# EAGLE schematic K104 (EAGLE 9.2.0)
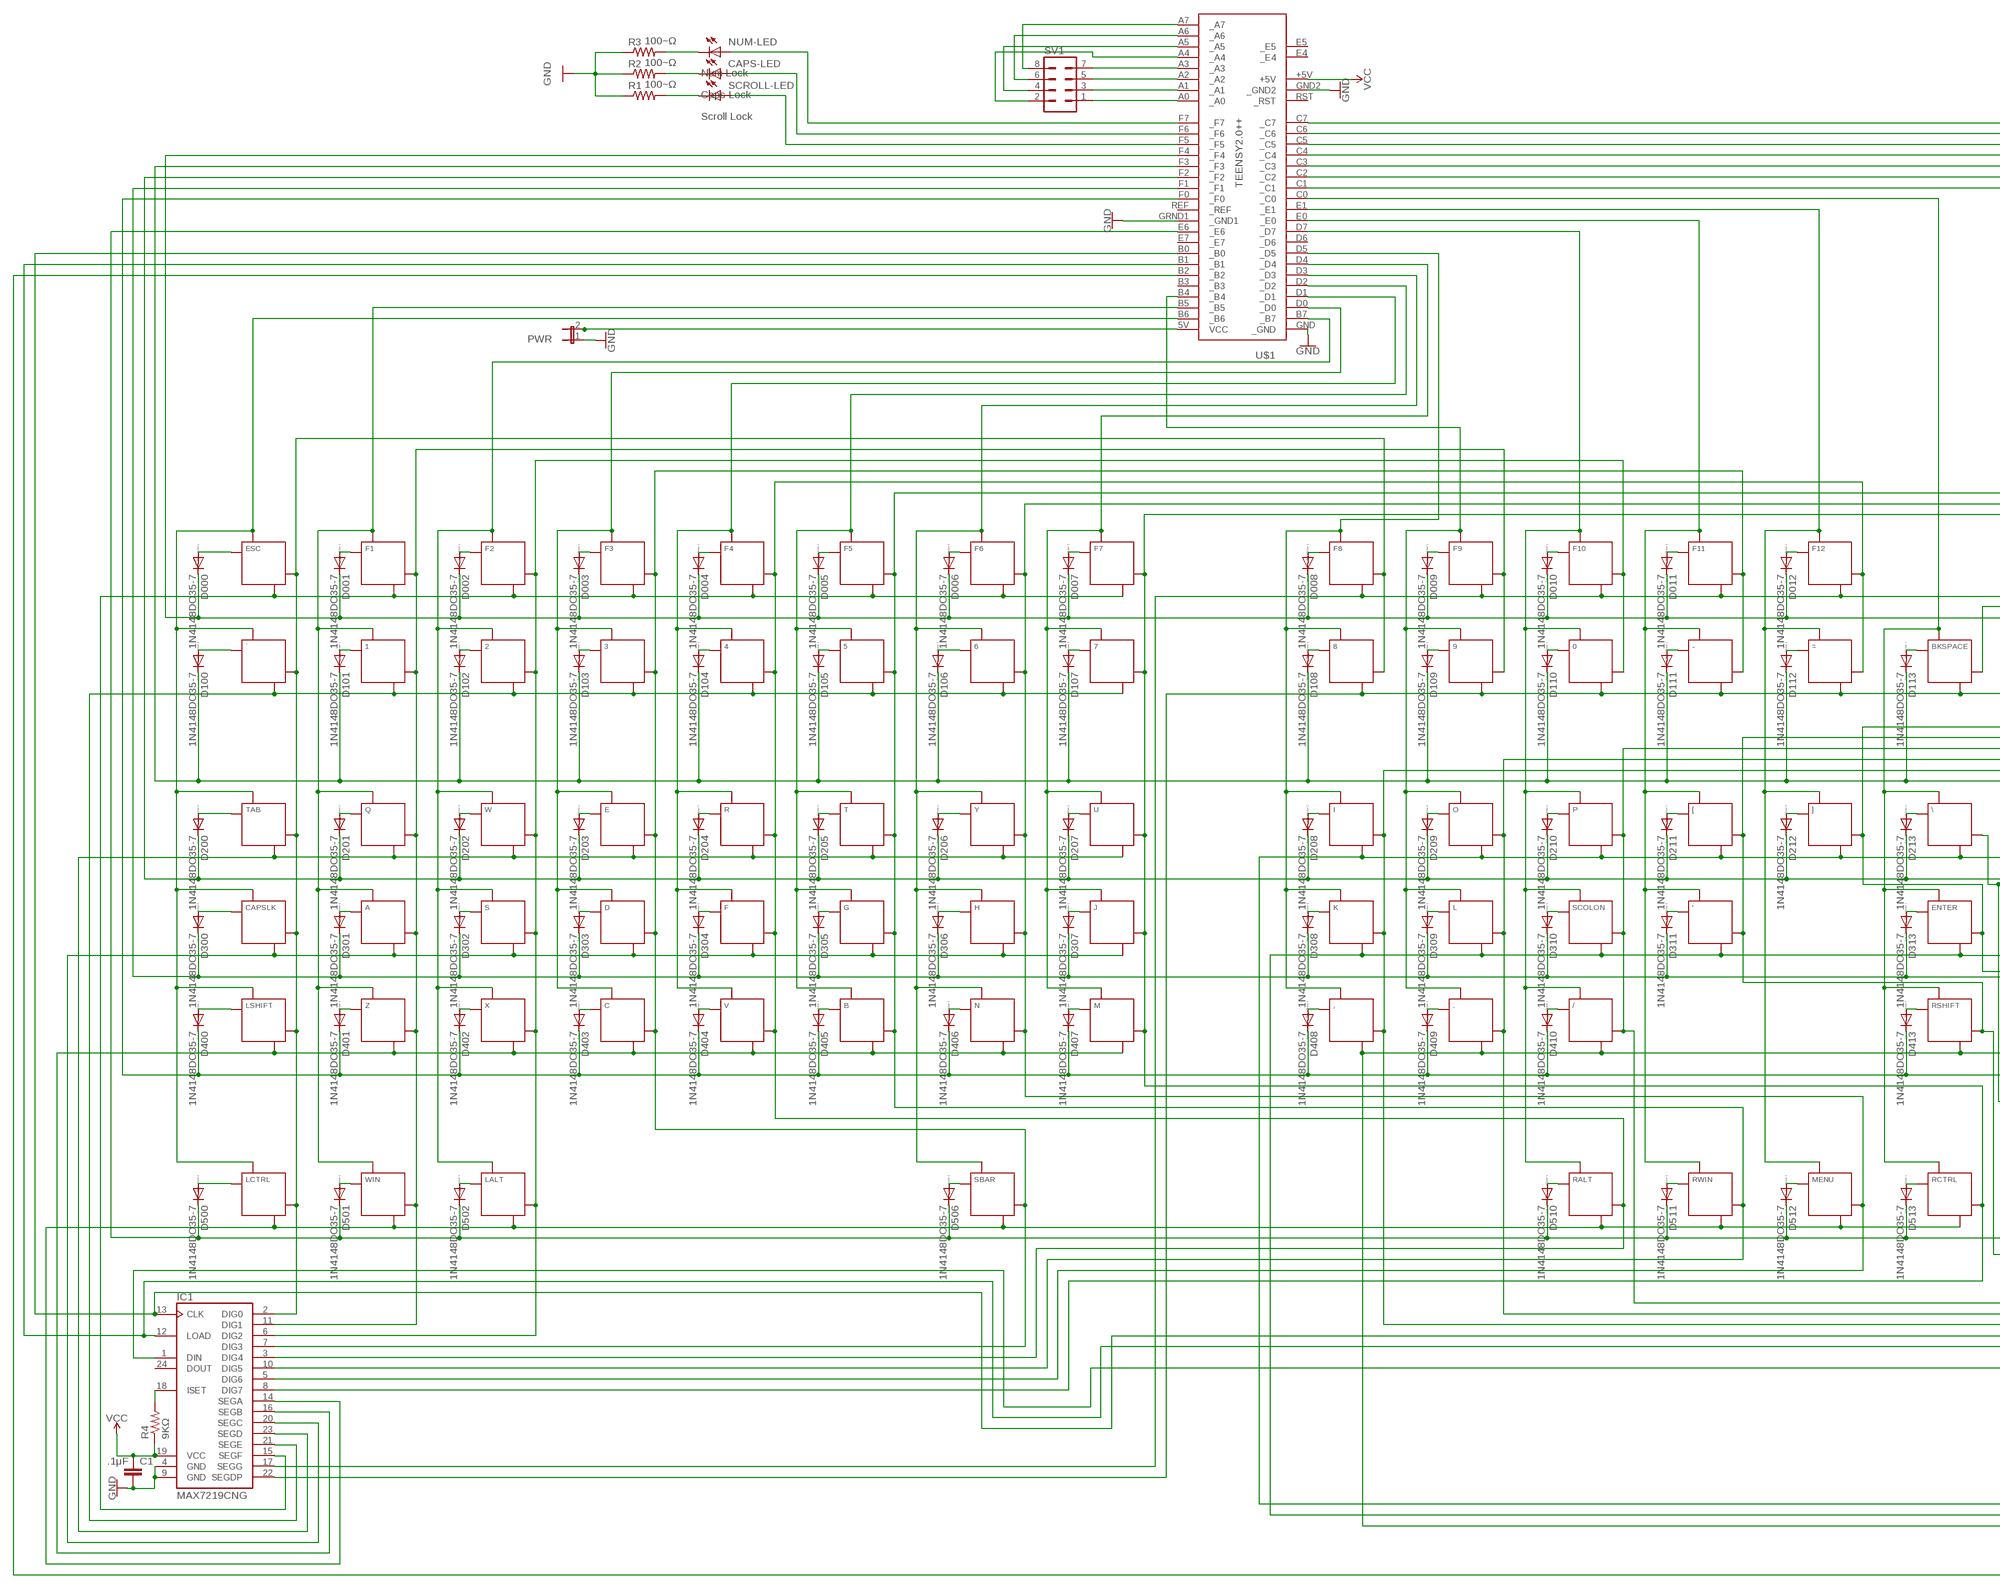
[diagram p0: schematic, sheet 1, part 1 of 2]
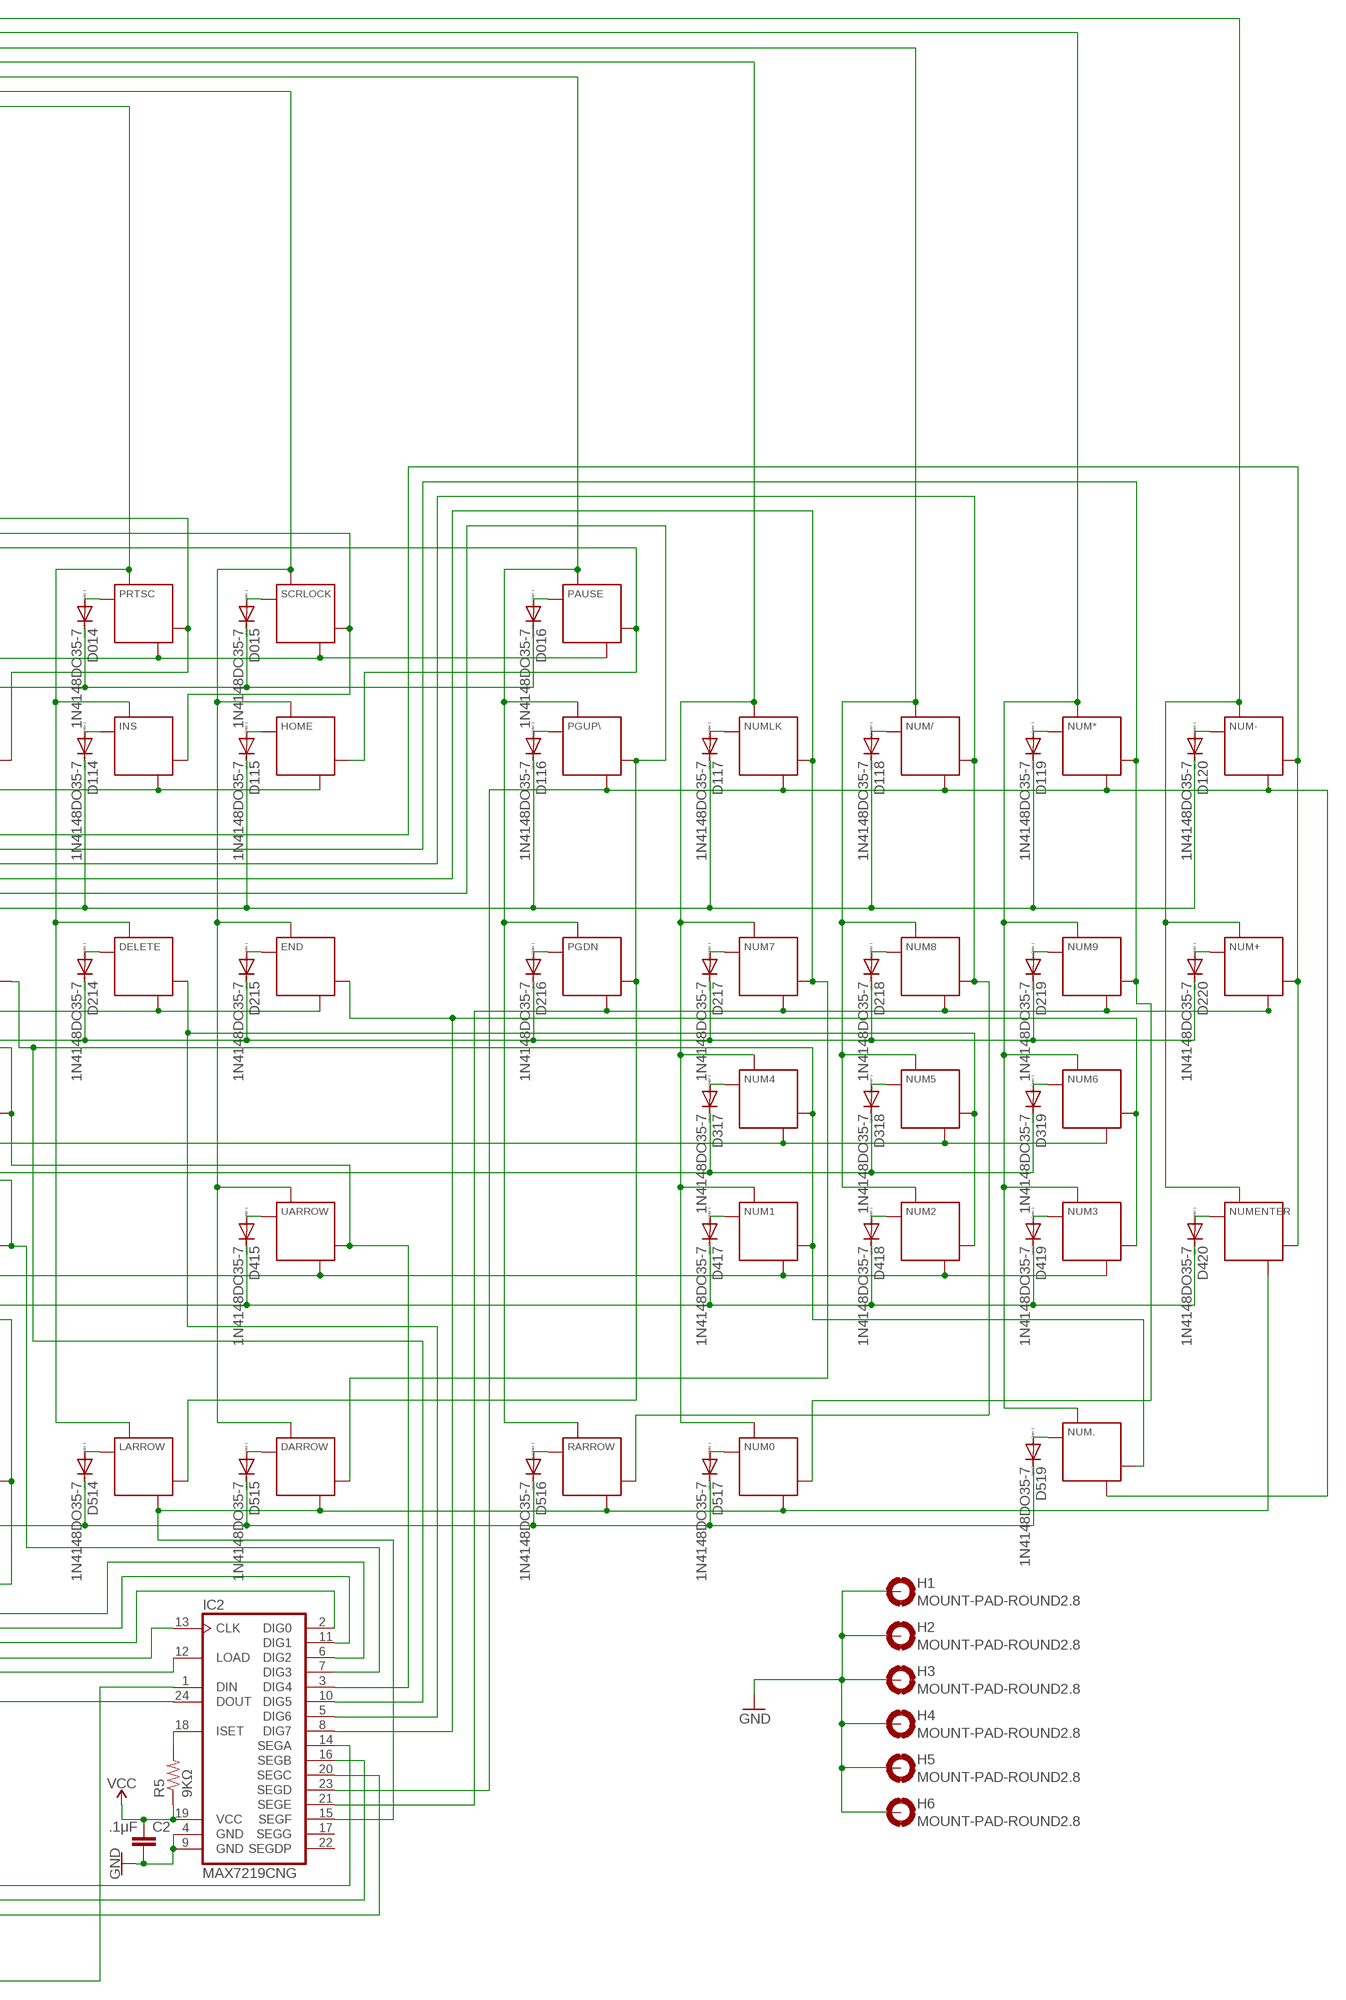
[diagram p1: schematic, sheet 1, part 2 of 2]

## Parts
0  KEYSWITCH-LED-MX-1U-LED  [MX-1U-LED]
1  KEYSWITCH-LED-MX-1U-LED  [MX-1U-LED]
2  KEYSWITCH-LED-MX-1U-LED  [MX-1U-LED]
3  KEYSWITCH-LED-MX-1U-LED  [MX-1U-LED]
4  KEYSWITCH-LED-MX-1U-LED  [MX-1U-LED]
5  KEYSWITCH-LED-MX-1U-LED  [MX-1U-LED]
6  KEYSWITCH-LED-MX-1U-LED  [MX-1U-LED]
7  KEYSWITCH-LED-MX-1U-LED  [MX-1U-LED]
8  KEYSWITCH-LED-MX-1U-LED  [MX-1U-LED]
9  KEYSWITCH-LED-MX-1U-LED  [MX-1U-LED]
'  KEYSWITCH-LED-MX-1U-LED  [MX-1U-LED]
,  KEYSWITCH-LED-MX-1U-LED  [MX-1U-LED]
-  KEYSWITCH-LED-MX-1U-LED  [MX-1U-LED]
.  KEYSWITCH-LED-MX-1U-LED  [MX-1U-LED]
/  KEYSWITCH-LED-MX-1U-LED  [MX-1U-LED]
=  KEYSWITCH-LED-MX-1U-LED  [MX-1U-LED]
[  KEYSWITCH-LED-MX-1U-LED  [MX-1U-LED]
\\  KEYSWITCH-LED-MX-1U-LED  [MX-1U-LED]
]  KEYSWITCH-LED-MX-1U-LED  [MX-1U-LED]
`  KEYSWITCH-LED-MX-1U-LED  [MX-1U-LED]
A  KEYSWITCH-LED-MX-1U-LED  [MX-1U-LED]
B  KEYSWITCH-LED-MX-1U-LED  [MX-1U-LED]
BKSPACE  KEYSWITCH-LED-MX-2U-LED  [MX-2U-LED]
C  KEYSWITCH-LED-MX-1U-LED  [MX-1U-LED]
C1  .1μF  C-EU025-024X044  [C025-024X044]
C2  .1μF  C-EU025-024X044  [C025-024X044]
CAPS-LED  Caps Lock  LED3MM  [LED3MM]
CAPSLK  KEYSWITCH-LED-MX-1U-LED  [MX-1U-LED]
D  KEYSWITCH-LED-MX-1U-LED  [MX-1U-LED]
D000  1N4148DO35-7  [DO35-7]
D001  1N4148DO35-7  [DO35-7]
D002  1N4148DO35-7  [DO35-7]
D003  1N4148DO35-7  [DO35-7]
D004  1N4148DO35-7  [DO35-7]
D005  1N4148DO35-7  [DO35-7]
D006  1N4148DO35-7  [DO35-7]
D007  1N4148DO35-7  [DO35-7]
D008  1N4148DO35-7  [DO35-7]
D009  1N4148DO35-7  [DO35-7]
D010  1N4148DO35-7  [DO35-7]
D011  1N4148DO35-7  [DO35-7]
D012  1N4148DO35-7  [DO35-7]
D014  1N4148DO35-7  [DO35-7]
D015  1N4148DO35-7  [DO35-7]
D016  1N4148DO35-7  [DO35-7]
D100  1N4148DO35-7  [DO35-7]
D101  1N4148DO35-7  [DO35-7]
D102  1N4148DO35-7  [DO35-7]
D103  1N4148DO35-7  [DO35-7]
D104  1N4148DO35-7  [DO35-7]
D105  1N4148DO35-7  [DO35-7]
D106  1N4148DO35-7  [DO35-7]
D107  1N4148DO35-7  [DO35-7]
D108  1N4148DO35-7  [DO35-7]
D109  1N4148DO35-7  [DO35-7]
D110  1N4148DO35-7  [DO35-7]
D111  1N4148DO35-7  [DO35-7]
D112  1N4148DO35-7  [DO35-7]
D113  1N4148DO35-7  [DO35-7]
D114  1N4148DO35-7  [DO35-7]
D115  1N4148DO35-7  [DO35-7]
D116  1N4148DO35-7  [DO35-7]
D117  1N4148DO35-7  [DO35-7]
D118  1N4148DO35-7  [DO35-7]
D119  1N4148DO35-7  [DO35-7]
D120  1N4148DO35-7  [DO35-7]
D200  1N4148DO35-7  [DO35-7]
D201  1N4148DO35-7  [DO35-7]
D202  1N4148DO35-7  [DO35-7]
D203  1N4148DO35-7  [DO35-7]
D204  1N4148DO35-7  [DO35-7]
D205  1N4148DO35-7  [DO35-7]
D206  1N4148DO35-7  [DO35-7]
D207  1N4148DO35-7  [DO35-7]
D208  1N4148DO35-7  [DO35-7]
D209  1N4148DO35-7  [DO35-7]
D210  1N4148DO35-7  [DO35-7]
D211  1N4148DO35-7  [DO35-7]
D212  1N4148DO35-7  [DO35-7]
D213  1N4148DO35-7  [DO35-7]
D214  1N4148DO35-7  [DO35-7]
D215  1N4148DO35-7  [DO35-7]
D216  1N4148DO35-7  [DO35-7]
D217  1N4148DO35-7  [DO35-7]
D218  1N4148DO35-7  [DO35-7]
D219  1N4148DO35-7  [DO35-7]
D220  1N4148DO35-7  [DO35-7]
D300  1N4148DO35-7  [DO35-7]
D301  1N4148DO35-7  [DO35-7]
D302  1N4148DO35-7  [DO35-7]
D303  1N4148DO35-7  [DO35-7]
D304  1N4148DO35-7  [DO35-7]
D305  1N4148DO35-7  [DO35-7]
D306  1N4148DO35-7  [DO35-7]
D307  1N4148DO35-7  [DO35-7]
D308  1N4148DO35-7  [DO35-7]
D309  1N4148DO35-7  [DO35-7]
D310  1N4148DO35-7  [DO35-7]
D311  1N4148DO35-7  [DO35-7]
D313  1N4148DO35-7  [DO35-7]
D317  1N4148DO35-7  [DO35-7]
D318  1N4148DO35-7  [DO35-7]
D319  1N4148DO35-7  [DO35-7]
D400  1N4148DO35-7  [DO35-7]
D401  1N4148DO35-7  [DO35-7]
D402  1N4148DO35-7  [DO35-7]
D403  1N4148DO35-7  [DO35-7]
D404  1N4148DO35-7  [DO35-7]
D405  1N4148DO35-7  [DO35-7]
D406  1N4148DO35-7  [DO35-7]
D407  1N4148DO35-7  [DO35-7]
D408  1N4148DO35-7  [DO35-7]
D409  1N4148DO35-7  [DO35-7]
D410  1N4148DO35-7  [DO35-7]
D413  1N4148DO35-7  [DO35-7]
D415  1N4148DO35-7  [DO35-7]
D417  1N4148DO35-7  [DO35-7]
D418  1N4148DO35-7  [DO35-7]
D419  1N4148DO35-7  [DO35-7]
D420  1N4148DO35-7  [DO35-7]
D500  1N4148DO35-7  [DO35-7]
D501  1N4148DO35-7  [DO35-7]
D502  1N4148DO35-7  [DO35-7]
D506  1N4148DO35-7  [DO35-7]
D510  1N4148DO35-7  [DO35-7]
D511  1N4148DO35-7  [DO35-7]
D512  1N4148DO35-7  [DO35-7]
D513  1N4148DO35-7  [DO35-7]
D514  1N4148DO35-7  [DO35-7]
D515  1N4148DO35-7  [DO35-7]
D516  1N4148DO35-7  [DO35-7]
D517  1N4148DO35-7  [DO35-7]
D519  1N4148DO35-7  [DO35-7]
DARROW  KEYSWITCH-LED-MX-1U-LED  [MX-1U-LED]
DELETE  KEYSWITCH-LED-MX-1U-LED  [MX-1U-LED]
E  KEYSWITCH-LED-MX-1U-LED  [MX-1U-LED]
END  KEYSWITCH-LED-MX-1U-LED  [MX-1U-LED]
ENTER  KEYSWITCH-LED-MX-2U-LED  [MX-2U-LED]
ESC  S001  KEYSWITCH-LED-MX-1U-LED  [MX-1U-LED]
F  KEYSWITCH-LED-MX-1U-LED  [MX-1U-LED]
F1  KEYSWITCH-LED-MX-1U-LED  [MX-1U-LED]
F2  KEYSWITCH-LED-MX-1U-LED  [MX-1U-LED]
F3  KEYSWITCH-LED-MX-1U-LED  [MX-1U-LED]
F4  KEYSWITCH-LED-MX-1U-LED  [MX-1U-LED]
F5  KEYSWITCH-LED-MX-1U-LED  [MX-1U-LED]
F6  KEYSWITCH-LED-MX-1U-LED  [MX-1U-LED]
F7  KEYSWITCH-LED-MX-1U-LED  [MX-1U-LED]
F8  KEYSWITCH-LED-MX-1U-LED  [MX-1U-LED]
F9  KEYSWITCH-LED-MX-1U-LED  [MX-1U-LED]
F10  KEYSWITCH-LED-MX-1U-LED  [MX-1U-LED]
F11  KEYSWITCH-LED-MX-1U-LED  [MX-1U-LED]
F12  KEYSWITCH-LED-MX-1U-LED  [MX-1U-LED]
G  KEYSWITCH-LED-MX-1U-LED  [MX-1U-LED]
H  KEYSWITCH-LED-MX-1U-LED  [MX-1U-LED]
H1  MOUNT-PAD-ROUND2.8  [2,8-PAD]
H2  MOUNT-PAD-ROUND2.8  [2,8-PAD]
H3  MOUNT-PAD-ROUND2.8  [2,8-PAD]
H4  MOUNT-PAD-ROUND2.8  [2,8-PAD]
H5  MOUNT-PAD-ROUND2.8  [2,8-PAD]
H6  MOUNT-PAD-ROUND2.8  [2,8-PAD]
HOME  KEYSWITCH-LED-MX-1U-LED  [MX-1U-LED]
I  KEYSWITCH-LED-MX-1U-LED  [MX-1U-LED]
IC1  MAX7219CNG  [DIL24-3]
IC2  MAX7219CNG  [DIL24-3]
INS  KEYSWITCH-LED-MX-1U-LED  [MX-1U-LED]
J  KEYSWITCH-LED-MX-1U-LED  [MX-1U-LED]
K  KEYSWITCH-LED-MX-1U-LED  [MX-1U-LED]
L  KEYSWITCH-LED-MX-1U-LED  [MX-1U-LED]
LALT  KEYSWITCH-LED-MX-1U-LED  [MX-1U-LED]
LARROW  KEYSWITCH-LED-MX-1U-LED  [MX-1U-LED]
LCTRL  KEYSWITCH-LED-MX-1U-LED  [MX-1U-LED]
LSHIFT  KEYSWITCH-LED-MX-2U-LED  [MX-2U-LED]
M  KEYSWITCH-LED-MX-1U-LED  [MX-1U-LED]
MENU  KEYSWITCH-LED-MX-1U-LED  [MX-1U-LED]
N  KEYSWITCH-LED-MX-1U-LED  [MX-1U-LED]
NUM0  KEYSWITCH-LED-MX-2U-LED  [MX-2U-LED]
NUM1  KEYSWITCH-LED-MX-1U-LED  [MX-1U-LED]
NUM2  KEYSWITCH-LED-MX-1U-LED  [MX-1U-LED]
NUM3  KEYSWITCH-LED-MX-1U-LED  [MX-1U-LED]
NUM4  KEYSWITCH-LED-MX-1U-LED  [MX-1U-LED]
NUM5  KEYSWITCH-LED-MX-1U-LED  [MX-1U-LED]
NUM6  KEYSWITCH-LED-MX-1U-LED  [MX-1U-LED]
NUM7  KEYSWITCH-LED-MX-1U-LED  [MX-1U-LED]
NUM8  KEYSWITCH-LED-MX-1U-LED  [MX-1U-LED]
NUM9  KEYSWITCH-LED-MX-1U-LED  [MX-1U-LED]
NUM*  KEYSWITCH-LED-MX-1U-LED  [MX-1U-LED]
NUM+  KEYSWITCH-LED-MX-2U-LED  [MX-2U-LED]
NUM-  KEYSWITCH-LED-MX-1U-LED  [MX-1U-LED]
NUM-LED  Num Lock  LED3MM  [LED3MM]
NUM.  KEYSWITCH-LED-MX-1U-LED  [MX-1U-LED]
NUM/  KEYSWITCH-LED-MX-1U-LED  [MX-1U-LED]
NUMENTER  KEYSWITCH-LED-MX-2U-LED  [MX-2U-LED]
NUMLK  KEYSWITCH-LED-MX-1U-LED  [MX-1U-LED]
O  KEYSWITCH-LED-MX-1U-LED  [MX-1U-LED]
P  KEYSWITCH-LED-MX-1U-LED  [MX-1U-LED]
PAUSE  KEYSWITCH-LED-MX-1U-LED  [MX-1U-LED]
PGDN  KEYSWITCH-LED-MX-1U-LED  [MX-1U-LED]
PGUP\  KEYSWITCH-LED-MX-1U-LED  [MX-1U-LED]
PRTSC  KEYSWITCH-LED-MX-1U-LED  [MX-1U-LED]
PWR  JP1E  [JP1]
Q  KEYSWITCH-LED-MX-1U-LED  [MX-1U-LED]
R  KEYSWITCH-LED-MX-1U-LED  [MX-1U-LED]
R1  100~Ω  R-US_0204/7  [0204/7]
R2  100~Ω  R-US_0204/7  [0204/7]
R3  100~Ω  R-US_0204/7  [0204/7]
R4  9KΩ  R-US_0204/7  [0204/7]
R5  9KΩ  R-US_0204/7  [0204/7]
RALT  KEYSWITCH-LED-MX-1U-LED  [MX-1U-LED]
RARROW  KEYSWITCH-LED-MX-1U-LED  [MX-1U-LED]
RCTRL  KEYSWITCH-LED-MX-1U-LED  [MX-1U-LED]
RSHIFT  KEYSWITCH-LED-MX-2U-LED  [MX-2U-LED]
RWIN  KEYSWITCH-LED-MX-1U-LED  [MX-1U-LED]
S  KEYSWITCH-LED-MX-1U-LED  [MX-1U-LED]
SBAR  KEYSWITCH-LED-MX-6.25U-LED  [MX-6.25U-LED]
SCOLON  KEYSWITCH-LED-MX-1U-LED  [MX-1U-LED]
SCRLOCK  KEYSWITCH-LED-MX-1U-LED  [MX-1U-LED]
SCROLL-LED  Scroll Lock  LED3MM  [LED3MM]
SV1  MA04-2  [MA04-2]
T  KEYSWITCH-LED-MX-1U-LED  [MX-1U-LED]
TAB  KEYSWITCH-LED-MX-1U-LED  [MX-1U-LED]
U  KEYSWITCH-LED-MX-1U-LED  [MX-1U-LED]
U$1  TEENSY2.0++  [TEENSY2.0++]
UARROW  KEYSWITCH-LED-MX-1U-LED  [MX-1U-LED]
V  KEYSWITCH-LED-MX-1U-LED  [MX-1U-LED]
W  KEYSWITCH-LED-MX-1U-LED  [MX-1U-LED]
WIN  KEYSWITCH-LED-MX-1U-LED  [MX-1U-LED]
X  KEYSWITCH-LED-MX-1U-LED  [MX-1U-LED]
Y  KEYSWITCH-LED-MX-1U-LED  [MX-1U-LED]
Z  KEYSWITCH-LED-MX-1U-LED  [MX-1U-LED]

## Nets
A0: SV1.1 U$1.A0(_A0)
A1: SV1.3 U$1.A1(_A1)
A2: SV1.5 U$1.A2(_A2)
A3: SV1.7 U$1.A3(_A3)
A4: SV1.2 U$1.A4(_A4)
A5: SV1.4 U$1.A5(_A5)
A6: SV1.6 U$1.A6(_A6)
A7: SV1.8 U$1.A7(_A7)
B0: IC1.13(CLK) IC2.13(CLK) U$1.B0(_B0)
B1: IC1.12(LOAD) IC2.12(LOAD) U$1.B1(_B1)
B2: IC2.1(DIN) U$1.B2(_B2)
B5: 1.MX2(P1) A.MX2(P1) F1.MX2(P1) Q.MX2(P1) U$1.B5(_B5) WIN.MX2(P1) Z.MX2(P1)
B6: `.MX2(P1) CAPSLK.MX2(P1) ESC.MX2(P1) LCTRL.MX2(P1) LSHIFT.MX2(P1) TAB.MX2(P1) U$1.B6(_B6)
B7: 2.MX2(P1) F2.MX2(P1) LALT.MX2(P1) S.MX2(P1) U$1.B7(_B7) W.MX2(P1) X.MX2(P1)
C0: \\.MX2(P1) BKSPACE.MX2(P1) ENTER.MX2(P1) RCTRL.MX2(P1) RSHIFT.MX2(P1) U$1.C0(_C0)
C1: DELETE.MX2(P1) INS.MX2(P1) LARROW.MX2(P1) PRTSC.MX2(P1) U$1.C1(_C1)
C2: DARROW.MX2(P1) END.MX2(P1) HOME.MX2(P1) SCRLOCK.MX2(P1) U$1.C2(_C2) UARROW.MX2(P1)
C3: PAUSE.MX2(P1) PGDN.MX2(P1) PGUP\.MX2(P1) RARROW.MX2(P1) U$1.C3(_C3)
C4: NUM0.MX2(P1) NUM1.MX2(P1) NUM4.MX2(P1) NUM7.MX2(P1) NUMLK.MX2(P1) U$1.C4(_C4)
C5: NUM2.MX2(P1) NUM5.MX2(P1) NUM8.MX2(P1) NUM/.MX2(P1) U$1.C5(_C5)
C6: NUM3.MX2(P1) NUM6.MX2(P1) NUM9.MX2(P1) NUM*.MX2(P1) NUM..MX2(P1) U$1.C6(_C6)
C7: NUM+.MX2(P1) NUM-.MX2(P1) NUMENTER.MX2(P1) U$1.C7(_C7)
D0: 3.MX2(P1) C.MX2(P1) D.MX2(P1) E.MX2(P1) F3.MX2(P1) U$1.D0(_D0)
D1: 4.MX2(P1) F4.MX2(P1) F.MX2(P1) R.MX2(P1) U$1.D1(_D1) V.MX2(P1)
D2: 5.MX2(P1) B.MX2(P1) F5.MX2(P1) G.MX2(P1) T.MX2(P1) U$1.D2(_D2)
D3: 6.MX2(P1) F6.MX2(P1) H.MX2(P1) N.MX2(P1) SBAR.MX2(P1) U$1.D3(_D3) Y.MX2(P1)
D4: 7.MX2(P1) F7.MX2(P1) J.MX2(P1) M.MX2(P1) U$1.D4(_D4) U.MX2(P1)
D5: 8.MX2(P1) ,.MX2(P1) F8.MX2(P1) I.MX2(P1) K.MX2(P1) U$1.D5(_D5)
D6: 9.MX2(P1) ..MX2(P1) F9.MX2(P1) L.MX2(P1) O.MX2(P1) U$1.B4(_B4)
D7: 0.MX2(P1) /.MX2(P1) F10.MX2(P1) P.MX2(P1) RALT.MX2(P1) SCOLON.MX2(P1) U$1.D7(_D7)
E0: '.MX2(P1) -.MX2(P1) [.MX2(P1) F11.MX2(P1) RWIN.MX2(P1) U$1.E0(_E0)
E1: =.MX2(P1) ].MX2(P1) F12.MX2(P1) MENU.MX2(P1) U$1.E1(_E1)
E6: D500.C D501.C D502.C D506.C D510.C D511.C D512.C D513.C D514.C D515.C D516.C D517.C D519.C U$1.E6(_E6)
F0: D400.C D401.C D402.C D403.C D404.C D405.C D406.C D407.C D408.C D409.C D410.C D413.C D415.C D417.C D418.C D419.C D420.C U$1.F0(_F0)
F1: D300.C D301.C D302.C D303.C D304.C D305.C D306.C D307.C D308.C D309.C D310.C D311.C D313.C D317.C D318.C D319.C U$1.F1(_F1)
F2: D200.C D201.C D202.C D203.C D204.C D205.C D206.C D207.C D208.C D209.C D210.C D211.C D212.C D213.C D214.C D215.C D216.C D217.C D218.C D219.C D220.C U$1.F2(_F2)
F3: D100.C D101.C D102.C D103.C D104.C D105.C D106.C D107.C D108.C D109.C D110.C D111.C D112.C D113.C D114.C D115.C D116.C D117.C D118.C D119.C D120.C U$1.F3(_F3)
F4: D000.C D001.C D002.C D003.C D004.C D005.C D006.C D007.C D008.C D009.C D010.C D011.C D012.C D014.C D015.C D016.C U$1.F4(_F4)
F5: SCROLL-LED.A U$1.F5(_F5)
F6: CAPS-LED.A U$1.F6(_F6)
F7: NUM-LED.A U$1.F7(_F7)
GND: C1.2 C2.2 H1.B2,8(MOUNT) H2.B2,8(MOUNT) H3.B2,8(MOUNT) H4.B2,8(MOUNT) H5.B2,8(MOUNT) H6.B2,8(MOUNT) IC1.4(GND) IC1.9(GND) IC2.4(GND) IC2.9(GND) PWR.1 R1.1 R2.1 R3.1 U$1.GND2(_GND2) U$1.GND(_GND) U$1.GRND1(_GND1)
IC1-2: 8.LED- `.LED- CAPSLK.LED- ESC.LED- F8.LED- IC1.2(DIG0) LCTRL.LED- LSHIFT.LED- TAB.LED-
IC1-3: 4.LED- =.LED- F4.LED- F12.LED- F.LED- IC1.3(DIG4) R.LED- RALT.LED- V.LED-
IC1-5: 6.LED- F6.LED- H.LED- IC1.5(DIG6) INS.LED- MENU.LED- N.LED- SCRLOCK.LED- Y.LED-
IC1-6: 0.LED- 2.LED- F2.LED- F10.LED- IC1.6(DIG2) LALT.LED- S.LED- W.LED- X.LED-
IC1-7: 3.LED- -.LED- C.LED- D.LED- E.LED- F3.LED- F11.LED- IC1.7(DIG3) SBAR.LED-
IC1-8: 7.LED- F7.LED- HOME.LED- IC1.8(DIG7) J.LED- M.LED- PAUSE.LED- RCTRL.LED- U.LED-
IC1-10: 5.LED- B.LED- BKSPACE.LED- F5.LED- G.LED- IC1.10(DIG5) PRTSC.LED- RWIN.LED- T.LED-
IC1-11: 1.LED- 9.LED- A.LED- F1.LED- F9.LED- IC1.11(DIG1) Q.LED- WIN.LED- Z.LED-
IC1-14: IC1.14(SEGA) LALT.LED+ LCTRL.LED+ MENU.LED+ RALT.LED+ RCTRL.LED+ RWIN.LED+ SBAR.LED+ WIN.LED+
IC1-15: ESC.LED+ F1.LED+ F2.LED+ F3.LED+ F4.LED+ F5.LED+ F6.LED+ F7.LED+ IC1.15(SEGF)
IC1-16: B.LED+ C.LED+ IC1.16(SEGB) LSHIFT.LED+ M.LED+ N.LED+ V.LED+ X.LED+ Z.LED+
IC1-17: F8.LED+ F9.LED+ F10.LED+ F11.LED+ F12.LED+ IC1.17(SEGG) PAUSE.LED+ PRTSC.LED+ SCRLOCK.LED+
IC1-20: A.LED+ CAPSLK.LED+ D.LED+ F.LED+ G.LED+ H.LED+ IC1.20(SEGC) J.LED+ S.LED+
IC1-21: 1.LED+ 2.LED+ 3.LED+ 4.LED+ 5.LED+ 6.LED+ 7.LED+ `.LED+ IC1.21(SEGE)
IC1-22: 0.LED+ 8.LED+ 9.LED+ -.LED+ =.LED+ BKSPACE.LED+ HOME.LED+ IC1.22(SEGDP) INS.LED+
IC1-23: E.LED+ IC1.23(SEGD) Q.LED+ R.LED+ T.LED+ TAB.LED+ U.LED+ W.LED+ Y.LED+
IC2-2: ,.LED- I.LED- IC2.2(DIG0) K.LED- LARROW.LED- PGDN.LED- PGUP\.LED-
IC2-3: ].LED- ENTER.LED- IC2.3(DIG4) NUM+.LED- NUM-.LED- NUMENTER.LED- UARROW.LED-
IC2-5: DELETE.LED- IC2.5(DIG6) NUM2.LED- NUM5.LED-
IC2-6: /.LED- IC2.6(DIG2) NUM8.LED- NUM/.LED- P.LED- RARROW.LED- SCOLON.LED-
IC2-7: '.LED- [.LED- IC2.7(DIG3) NUM0.LED- NUM9.LED- NUM*.LED- RSHIFT.LED-
IC2-8: END.LED- IC2.8(DIG7) NUM3.LED- NUM6.LED-
IC2-10: \\.LED- IC2.10(DIG5) NUM1.LED- NUM4.LED- NUM..LED-
IC2-11: ..LED- DARROW.LED- IC2.11(DIG1) L.LED- NUM7.LED- NUMLK.LED- O.LED-
IC2-14: [.LED+ \\.LED+ ].LED+ DELETE.LED+ END.LED+ I.LED+ IC2.14(SEGA) O.LED+ P.LED+
IC2-15: DARROW.LED+ IC2.15(SEGF) LARROW.LED+ NUM0.LED+ NUMENTER.LED+ RARROW.LED+
IC2-16: '.LED+ ENTER.LED+ IC2.16(SEGB) K.LED+ L.LED+ NUM4.LED+ NUM5.LED+ NUM6.LED+ SCOLON.LED+
IC2-20: ,.LED+ ..LED+ /.LED+ IC2.20(SEGC) NUM1.LED+ NUM2.LED+ NUM3.LED+ RSHIFT.LED+ UARROW.LED+
IC2-21: IC2.21(SEGE) NUM7.LED+ NUM8.LED+ NUM9.LED+ NUM+.LED+ PGDN.LED+
IC2-23: IC2.23(SEGD) NUM*.LED+ NUM-.LED+ NUM..LED+ NUM/.LED+ NUMLK.LED+ PGUP\.LED+
IC2-DOUT: IC1.1(DIN) IC2.24(DOUT)
N$1: D000.A ESC.MX1(P0)
N$2: D001.A F1.MX1(P0)
N$3: D002.A F2.MX1(P0)
N$4: D116.A PGUP\.MX1(P0)
N$5: D003.A F3.MX1(P0)
N$6: D004.A F4.MX1(P0)
N$7: `.MX1(P0) D100.A
N$8: D011.A F11.MX1(P0)
N$9: D005.A F5.MX1(P0)
N$10: D006.A F6.MX1(P0)
N$11: D007.A F7.MX1(P0)
N$12: D008.A F8.MX1(P0)
N$13: D009.A F9.MX1(P0)
N$14: D014.A PRTSC.MX1(P0)
N$15: D010.A F10.MX1(P0)
N$16: 1.MX1(P0) D101.A
N$17: D012.A F12.MX1(P0)
N$18: D015.A SCRLOCK.MX1(P0)
N$19: 2.MX1(P0) D102.A
N$20: D016.A PAUSE.MX1(P0)
N$21: 3.MX1(P0) D103.A
N$22: 7.MX1(P0) D107.A
N$23: 4.MX1(P0) D104.A
N$24: 5.MX1(P0) D105.A
N$25: 6.MX1(P0) D106.A
N$26: 8.MX1(P0) D108.A
N$27: 9.MX1(P0) D109.A
N$28: 0.MX1(P0) D110.A
N$29: -.MX1(P0) D111.A
N$30: =.MX1(P0) D112.A
N$31: BKSPACE.MX1(P0) D113.A
N$32: D201.A Q.MX1(P0)
N$33: D200.A TAB.MX1(P0)
N$35: D308.A K.MX1(P0)
N$36: D202.A W.MX1(P0)
N$37: D302.A S.MX1(P0)
N$38: A.MX1(P0) D301.A
N$39: D402.A X.MX1(P0)
N$40: D401.A Z.MX1(P0)
N$42: C.MX1(P0) D403.A
N$43: D304.A F.MX1(P0)
N$44: D204.A R.MX1(P0)
N$45: D404.A V.MX1(P0)
N$46: B.MX1(P0) D405.A
N$47: D305.A G.MX1(P0)
N$48: D303.A D.MX1(P0)
N$49: D205.A T.MX1(P0)
N$50: D206.A Y.MX1(P0)
N$51: D207.A U.MX1(P0)
N$52: D307.A J.MX1(P0)
N$53: D407.A M.MX1(P0)
N$54: D406.A N.MX1(P0)
N$55: D306.A H.MX1(P0)
N$56: D208.A I.MX1(P0)
N$57: D209.A O.MX1(P0)
N$58: D309.A L.MX1(P0)
N$59: ..MX1(P0) D409.A
N$60: ,.MX1(P0) D408.A
N$61: /.MX1(P0) D410.A
N$62: D310.A SCOLON.MX1(P0)
N$63: D210.A P.MX1(P0)
N$64: [.MX1(P0) D211.A
N$65: '.MX1(P0) D311.A
N$66: D400.A LSHIFT.MX1(P0)
N$67: ].MX1(P0) D212.A
N$68: \\.MX1(P0) D213.A
N$69: D313.A ENTER.MX1(P0)
N$70: D216.A PGDN.MX1(P0)
N$71: D215.A END.MX1(P0)
N$72: D214.A DELETE.MX1(P0)
N$73: D415.A UARROW.MX1(P0)
N$74: D516.A RARROW.MX1(P0)
N$75: D515.A DARROW.MX1(P0)
N$76: D514.A LARROW.MX1(P0)
N$77: D413.A RSHIFT.MX1(P0)
N$78: D512.A MENU.MX1(P0)
N$79: D511.A RWIN.MX1(P0)
N$80: D510.A RALT.MX1(P0)
N$81: CAPSLK.MX1(P0) D300.A
N$84: D203.A E.MX1(P0)
N$85: NUM-LED.K(C) R3.2
N$86: CAPS-LED.K(C) R2.2
N$87: D500.A LCTRL.MX1(P0)
N$88: D501.A WIN.MX1(P0)
N$89: D502.A LALT.MX1(P0)
N$90: D506.A SBAR.MX1(P0)
N$91: R1.2 SCROLL-LED.K(C)
N$92: D114.A INS.MX1(P0)
N$93: D115.A HOME.MX1(P0)
N$94: D513.A RCTRL.MX1(P0)
N$98: D217.A NUM7.MX1(P0)
N$99: D117.A NUMLK.MX1(P0)
N$101: D517.A NUM0.MX1(P0)
N$102: D417.A NUM1.MX1(P0)
N$103: D317.A NUM4.MX1(P0)
N$104: D218.A NUM8.MX1(P0)
N$105: D118.A NUM/.MX1(P0)
N$108: D418.A NUM2.MX1(P0)
N$109: D318.A NUM5.MX1(P0)
N$110: D219.A NUM9.MX1(P0)
N$111: D119.A NUM*.MX1(P0)
N$113: D519.A NUM..MX1(P0)
N$114: D419.A NUM3.MX1(P0)
N$115: D319.A NUM6.MX1(P0)
N$116: D220.A NUM+.MX1(P0)
N$117: D120.A NUM-.MX1(P0)
N$120: D420.A NUMENTER.MX1(P0)
N$143: IC1.18(ISET) R4.2
N$145: IC2.18(ISET) R5.2
VCC: C1.1 C2.1 IC1.19(VCC) IC2.19(VCC) R4.1 R5.1 U$1.+5V
VCC2: PWR.2 U$1.5V(VCC)
Unconnected: IC1.24(DOUT) IC2.17(SEGG) IC2.22(SEGDP) U$1.B3(_B3) U$1.D6(_D6) U$1.E4(_E4) U$1.E5(_E5) U$1.E7(_E7) U$1.REF(_REF) U$1.RST(_RST)

## Library data of the parts
0 1-9 ' , - . / = [ \\ ] ` A B BKSPACE C CAPSLK D DARROW DELETE E END ENTER ESC F F1-F12 G H HOME I INS J K L LALT LARROW LCTRL LSHIFT M MENU N NUM0 NUM1-NUM9 NUM* NUM+ NUM- NUM. NUM/ NUMENTER NUMLK O P PAUSE PGDN PGUP\ PRTSC Q R RALT RARROW RCTRL RSHIFT RWIN S SBAR SCOLON SCRLOCK T TAB U UARROW V W WIN X Y Z = Keyboard:KEYSWITCH-LED
C1 C2 = resistor:C-EU: CAPACITOR, European symbol
CAPS-LED NUM-LED SCROLL-LED = led:LED: LED OSRAM: - CHIPLED LG R971, LG N971, LY N971, LG Q971, LY Q971, LO R971, LY R971 LH N974, LH R974 LS Q976, LO Q976, LY Q976 LO Q996 - Hyper CHIPLED LW Q18S LB Q993, LB Q99A, LB R99A - SideLED LS A670, LO A670, LY A670, LG A670, LP A670 LB A673, LV A673, LT A673, LW A673 LH A674 LY A675 LS A676, LA A676, LO A676, LY A676, LW A676 LS A679, LY A679, LG A679 - Hyper Micro SIDELED® LS Y876, LA Y876, LO Y876, LY Y876 LT Y87S - SmartLED LW L88C, LW L88S LB L89C, LB L89S, LG L890 LS L89K, LO L89K, LY L89K LS L896, LA L896, LO L896, LY L896 - TOPLED LS T670, LO T670, LY T670, LG T670, LP T670 LSG T670, LSP T670, LSY T670, LOP T670, LYG T670 LG T671, LOG T671, LSG T671 LB T673, LV T673, LT T673, LW T673 LH T674 LS T676, LA T676, LO T676, LY T676, LB T676, LH T676, LSB T676, LW T676 LB T67C, LV T67C, LT T67C, LS T67K, LO T67K, LY T67K, LW E67C LS E67B, LA E67B, LO E67B, LY E67B, LB E67C, LV E67C, LT E67C LW T67C LS T679, LY T679, LG T679 LS T770, LO T770, LY T770, LG T770, LP T770 LB T773, LV T773, LT T773, LW T773 LH T774 LS E675, LA E675, LY E675, LS T675 LS T776, LA T776, LO T776, LY T776, LB T776 LHGB T686 LT T68C, LB T68C - Hyper Mini TOPLED® LB M676 - Mini TOPLED Santana® LG M470 LS M47K, LO M47K, LY M47K Source: http://www.osram.convergy.de LUXEON: - LUMILED® LXK2-PW12-R00, LXK2-PW12-S00, LXK2-PW14-U00, LXK2-PW14-V00 LXK2-PM12-R00, LXK2-PM12-S00, LXK2-PM14-U00 LXK2-PE12-Q00, LXK2-PE12-R00, LXK2-PE12-S00, LXK2-PE14-T00, LXK2-PE14-U00 LXK2-PB12-K00, LXK2-PB12-L00, LXK2-PB12-M00, LXK2-PB14-N00, LXK2-PB14-P00, LXK2-PB14-Q00 LXK2-PR12-L00, LXK2-PR12-M00, LXK2-PR14-Q00, LXK2-PR14-R00 LXK2-PD12-Q00, LXK2-PD12-R00, LXK2-PD12-S00 LXK2-PH12-R00, LXK2-PH12-S00 LXK2-PL12-P00, LXK2-PL12-Q00, LXK2-PL12-R00 Source: www.luxeon.com KINGBRIGHT: KA-3528ASYC Source: www.kingbright.com
D000 D001-D009 D010-D012 D014-D016 D100-D120 D200-D220 D300-D311 D313 D317-D319 D400-D410 D413 D415 D417-D420 D500-D502 D506 D510-D517 D519 = diode:1N4148: DIODE high speed (Philips)
H1-H6 = con-haxn:MOUNT-PAD-ROUND: MOUNTING PAD, round
IC1 IC2 = max7219:MAX7219CNG: LED DISPLAY DRIVER; MF: MAXIM; MPN: MAX7219CNG; OC_FARNELL: 1523914; OC_NEWARK: 34C4018
PWR = jumper:JP1E: JUMPER
R1-R3 = resistor:R-US_: RESISTOR, American symbol
R4 R5 = rcl:R-US_: RESISTOR, American symbol; SPICEPREFIX: R
SV1 = con-lstb:MA04-2: PIN HEADER; OC_FARNELL: unknown; OC_NEWARK: unknown
U$1 = teensy:TEENSY2.0++: Teensy 2.0 ++

## Net classes
0 default: clearance 0.205 mm